# Altium schematic sheet Isolated Supply.SchDoc
size A4; DocumentNumber: 2; SheetNumber: 2; SheetTotal: 3
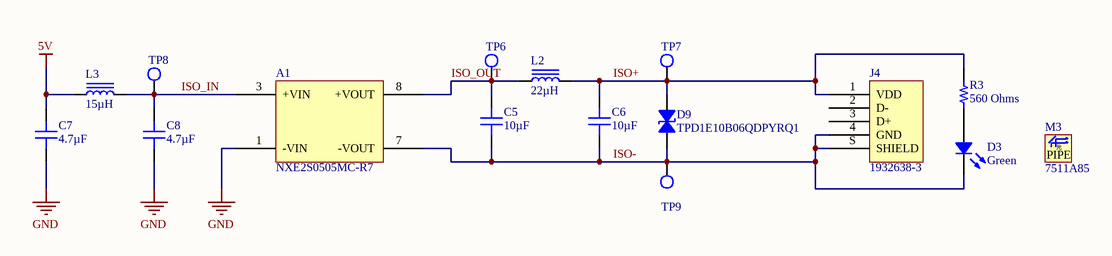
[diagram p0: Isolated Supply.SchDoc]

## Parts
A1  NXE2S0505MC-R7  [MURATA NXE]
C5  10µF  [CAP 1206_3216 - 1.8MM]
C6  10µF  [CAP 1206_3216 - 1.8MM]
C7  4.7µF  [CAP 1206_3216 - 1.8MM]
C8  4.7µF  [CAP 1206_3216 - 1.8MM]
D3  Green  [LED 0805_2012 GREEN]
D9  TPD1E10B06QDPYRQ1  [0402]
J4  1932638-3  [TE 1932638-3 USB2.0A]
L2  22µH  [TDK VLCF4024-2]
L3  15µH  [TDK VLCF4028-2]
M3  7511A85  [VCC 7511A85]
R3  560 Ohms  [RES 0603_1608]
TP6  Test Point  [TestPoint-1.5mm]  (value not drawn)  (no BOM)
TP7  Test Point  [TestPoint-1.5mm]  (value not drawn)  (no BOM)
TP8  Test Point  [TestPoint-1.5mm]  (value not drawn)  (no BOM)
TP9  Test Point  [TestPoint-1.5mm]  (value not drawn)  (no BOM)

## Nets
5V: C7.1 L3.1
GND: A1.1(-VIN) C7.2 C8.2
ISO+: C6.1 D9.2 J4.1(VDD) L2.2 R3.1 TP7.1(TP)
ISO-: A1.7(-VOUT) C5.2 C6.2 D3.2 D9.1 J4.4(GND) J4.S(SHIELD) TP9.1(TP)
ISO_IN: A1.3(+VIN) C8.1 L3.2 TP8.1(TP)
ISO_OUT: A1.8(+VOUT) C5.1 L2.1 TP6.1(TP)
NetD3_1: D3.1 R3.2

Not connected (* = marked no-connect by the designer): J4 2(D-) 3(D+)

## Notes on the sheet
- Title
- Size:
- Date:
- A4
- Number:
- Time:
- Revision:
- Sheet
- of
- File:
- (in symbol 7511A85) 光; PIPE

## Library data of the parts
A1 = NXE2S0505MC-R7: DC DC CONVERTER 5V 2W; Manufacturer: Murata Power Solutions Inc.; Current - Output (Max): 400mA; Efficiency: 72%; Number of Outputs: 1; Voltage - Input (Max): 5.5V; Voltage - Input (Min): 4.5V; Voltage - Isolation: 3kV; Part Number: NXE2S0505MC-R7; Applications: ITE (Commercial); ComponentLink1Description: Datasheet; ComponentLink1URL: https://power.murata.com/data/power/ncl/kdc_nxe2.pdf; ComponentLink2Description: DigiKey Link; ComponentLink2URL: //digikey.com/product-detail/en/murata-power-solutions-inc/NXE2S0505MC-R7/811-3182-2-ND/6009739; Device Package: 14-SMD Module, 5 Leads; Features: SCP; LastUpdated: 04/12/2019 23:42:39; Lifecycle Status: 0; Minimum Order: 1; Mounting Type: Surface Mount; Operating Temperature: -40°C ~ 85°C; Package / Case: 14-SMD Module, 5 Leads; Packaging: TapeAndReel; PartId: 2; Part Status: Active; Power (Watts): 2W; Price: 3.83; Series: NXE2 (2W); Size / Dimension: 0.50" L x 0.40" W x 0.17" H (12.7mm x 10.4mm x 4.4mm); Supplier 1: DigiKey; Supplier Part Number 1: 811-3182-2-ND; Type: Isolated Module; Voltage - Output 1: 5V
C5 C6 = CL31B106MOHNNNE: CAP CER 10UF 16V X7R 1206; Manufacturer: Samsung Electro-Mechanics; Tolerance: ±20%; Part Number: CL31B106MOHNNNE; Applications: General Purpose; Capacitance: 10µF; ComponentLink1Description: Datasheet; ComponentLink1URL: http://www.samsungsem.com/kr/support/product-search/mlcc/CL31B106MOHNNNE.jsp; ComponentLink2Description: DigiKey Link; ComponentLink2URL: //digikey.com/product-detail/en/samsung-electro-mechanics/CL31B106MOHNNNE/1276-6641-2-ND/5961125; Device Package: 1206 (3216 Metric); LastUpdated: 29/11/2019 21:36:18; Lifecycle Status: 0; Minimum Order: 1; Mounting Type: Surface Mount, MLCC; Operating Temperature: -55°C ~ 125°C; Package / Case: 1206 (3216 Metric); Packaging: TapeAndReel; PartId: 21983; Part Status: Active; Price: 0.04; Series: CL; Size / Dimension: 0.126" L x 0.063" W (3.20mm x 1.60mm); Supplier 1: DigiKey; Supplier Part Number 1: 1276-6641-2-ND; Temperature Coefficient: X7R; Thickness (Max): 0.071" (1.80mm); Value: 10µF; Voltage - Rated: 16V
C7 C8 = CL31B475KOHNNNE: CAP CER 4.7UF 16V X7R 1206; Manufacturer: Samsung Electro-Mechanics; Tolerance: ±10%; Part Number: CL31B475KOHNNNE; Applications: General Purpose; Capacitance: 4.7µF; ComponentLink1Description: Datasheet; ComponentLink1URL: http://www.samsungsem.com/kr/support/product-search/mlcc/CL31B475KOHNNNE.jsp; ComponentLink2Description: DigiKey Link; ComponentLink2URL: //digikey.com/product-detail/en/samsung-electro-mechanics/CL31B475KOHNNNE/1276-3182-2-ND/3888840; Device Package: 1206 (3216 Metric); LastUpdated: 29/11/2019 21:36:24; Lifecycle Status: 0; Minimum Order: 1; Mounting Type: Surface Mount, MLCC; Operating Temperature: -55°C ~ 125°C; Package / Case: 1206 (3216 Metric); Packaging: TapeAndReel; PartId: 22712; Part Status: Active; Price: 0.05; Series: CL; Size / Dimension: 0.126" L x 0.063" W (3.20mm x 1.60mm); Supplier 1: DigiKey; Supplier Part Number 1: 1276-3182-2-ND; Temperature Coefficient: X7R; Thickness (Max): 0.071" (1.80mm); Value: 4.7µF; Voltage - Rated: 16V
D3 = LTST-C170GKT: LED GREEN CLEAR SMD; Manufacturer: Lite-On Inc.; Configuration: Standard; Current - Test: 10mA; Lens Color: Colorless; Lens Size: 1.40mm x 1.25mm; Lens Style: Rectangle with Flat Top; Millicandela Rating: 6mcd; Viewing Angle: 130°; Voltage - Forward (Vf) (Typ): 2.1V; Wavelength - Dominant: 569nm; Wavelength - Peak: 565nm; Part Number: LTST-C170GKT; Color: Green; ComponentLink1Description: Datasheet; ComponentLink1URL: //media.digikey.com/pdf/Data%20Sheets/Lite-On%20PDFs/LTST-C170GKT.pdf; ComponentLink2Description: DigiKey Link; ComponentLink2URL: http://digikey.com/product-detail/en/lite-on-inc/LTST-C170GKT/160-1179-1-ND/269251; Device Package: 0805 (2012 Metric); Height (Max): 1.10mm; LastUpdated: 21/01/2020 03:14:10; Lens Transparency: Clear; Lifecycle Status: Active; Minimum Order: 1; Mounting Type: Surface Mount; Package / Case: 0805 (2012 Metric); Packaging: TapeAndReel; PartId: 282; Part Status: Active; Price: 0.05; Series: -; Size / Dimension: 2.00mm L x 1.25mm W; Supplier 1: DigiKey; Supplier Part Number 1: 160-1179-1-ND; Value: Green
D9 = TPD1E10B06QDPYRQ1: TVS DIODE 5.5V 14V 2X1SON; Manufacturer: Texas Instruments; Bidirectional Channels: 1; Capacitance @ Frequency: 12pF @ 1MHz; Current - Peak Pulse (10/1000µs): 6A (8/20µs); Power Line Protection: No; Power - Peak Pulse: 90W; Type: Zener; Voltage - Breakdown (Min): 6V; Voltage - Clamping (Max) @ Ipp: 14V (Typ); Voltage - Reverse Standoff (Typ): 5.5V (Max); Part Number: TPD1E10B06QDPYRQ1; Applications: Automotive; ComponentLink1Description: Datasheet; ComponentLink1URL: http://www.ti.com/general/docs/suppproductinfo.tsp?distId=10&gotoUrl=http%3A%2F%2Fwww.ti.com%2Flit%2Fgpn%2Ftpd1e10b06-q1; ComponentLink2Description: DigiKey Link; ComponentLink2URL: http://digikey.com/product-detail/en/texas-instruments/TPD1E10B06QDPYRQ1/296-TPD1E10B06QDPYRQ1CT-ND/6609868; Device Package: 0402 (1006 Metric); LastUpdated: 21/03/2020 02:05:15; Lifecycle Status: Active; Minimum Order: 1; Mounting Type: Surface Mount; Operating Temperature: -40°C ~ 125°C (TA); Package / Case: 0402 (1006 Metric); Packaging: TapeAndReel; PartId: 10475; Part Status: Active; Price: 0.08; Series: Automotive, AEC-Q101; Supplier 1: DigiKey; Supplier Part Number 1: 296-TPD1E10B06QDPYRQ1CT-ND; Supplier Device Package: 2-X1SON (1x.60)
J4 = 1932638-3: CONN RCPT USB2.0 TYPEA 4P SMD RA; Manufacturer: TE Connectivity AMP Connectors; Connector Type: USB - A; Current Rating (Amps): 1A per Contact; Gender: Receptacle; Mating Cycles: 1500; Number of Contacts: 4; Number of Ports: 1; Shielding: Shielded; Voltage - Rated: 30VAC; Part Number: 1932638-3; ComponentLink1Description: Datasheet; ComponentLink1URL: https://www.te.com/commerce/DocumentDelivery/DDEController?Action=srchrtrv&DocNm=501-60007-1&DocType=SS&DocLang=EN; ComponentLink2Description: DigiKey Link; ComponentLink2URL: //digikey.com/product-detail/en/te-connectivity-amp-connectors/1932638-3/A117902TR-ND/4731612; Features: Solder Retention; LastUpdated: 09/12/2019 20:47:08; Lifecycle Status: 0; Minimum Order: 1; Mounting Feature: Horizontal; Mounting Type: Surface Mount, Right Angle; Operating Temperature: -55°C ~ 85°C; Packaging: TapeAndReel; Part Status: Active; Price: 0.97; Series: -; Specifications: USB 2.0; Supplier 1: DigiKey; Supplier Part Number 1: A117902TR-ND; Termination: Solder
L2 = VLCF4024T-220MR65-2: FIXED IND 22UH 650MA 332 MOHM; Manufacturer: TDK Corporation; DC Resistance (DCR): 332mOhm Max; Inductance Frequency - Test: 100kHz; Material - Core: Ferrite; Shielding: Shielded; Tolerance: ±20%; Type: Wirewound; Part Number: VLCF4024T-220MR65-2; ComponentLink1Description: Datasheet; ComponentLink1URL: https://product.tdk.com/info/en/catalog/datasheets/inductor_commercial_power_vlcf4024-2_en.pdf?ref_disty=digikey; ComponentLink2Description: DigiKey Link; ComponentLink2URL: //digikey.com/product-detail/en/tdk-corporation/VLCF4024T-220MR65-2/445-8732-2-ND/3083283; Current Rating (Amps): 650mA; Current - Saturation: 650mA; Device Package: Nonstandard; Height - Seated (Max): 0.094" (2.40mm); Inductance: 22µH; LastUpdated: 02/12/2019 13:29:53; Lifecycle Status: 0; Minimum Order: 1; Mounting Type: Surface Mount; Operating Temperature: -40°C ~ 105°C; Package / Case: Nonstandard; Packaging: TapeAndReel; PartId: 165; Part Status: Active; Price: 0.44; Series: VLCF; Size / Dimension: 0.157" L x 0.157" W (4.00mm x 4.00mm); Supplier 1: DigiKey; Supplier Part Number 1: 445-8732-2-ND; Value: 22µH
L3 = VLCF4028T-150MR88-2: FIXED IND 15UH 880MA 170 MOHM; Manufacturer: TDK Corporation; DC Resistance (DCR): 170mOhm Max; Inductance Frequency - Test: 100kHz; Material - Core: Ferrite; Shielding: Shielded; Tolerance: ±20%; Type: Wirewound; Part Number: VLCF4028T-150MR88-2; ComponentLink1Description: Datasheet; ComponentLink1URL: https://product.tdk.com/info/en/catalog/datasheets/inductor_commercial_power_vlcf4028-2_en.pdf?ref_disty=digikey; ComponentLink2Description: DigiKey Link; ComponentLink2URL: //digikey.com/product-detail/en/tdk-corporation/VLCF4028T-150MR88-2/445-6543-2-ND/2465300; Current Rating (Amps): 880mA; Current - Saturation: 880mA; Device Package: Nonstandard; Height - Seated (Max): 0.110" (2.80mm); Inductance: 15µH; LastUpdated: 02/12/2019 13:32:15; Lifecycle Status: 0; Minimum Order: 1; Mounting Type: Surface Mount; Operating Temperature: -40°C ~ 105°C; Package / Case: Nonstandard; Packaging: TapeAndReel; PartId: 183; Part Status: Active; Price: 0.44; Series: VLCF; Size / Dimension: 0.157" L x 0.157" W (4.00mm x 4.00mm); Supplier 1: DigiKey; Supplier Part Number 1: 445-6543-2-ND; Value: 15µH
M3 = 7511A85: LIGHT PIPE RIGHT ANG SINGLE POS; Manufacturer: Visual Communications Company - VCC; Lens Size: 3mm; Lens Style: Round with Flat Top; Color: Clear; ComponentLink1Description: Datasheet; ComponentLink1URL: https://vcclite.com/wp-content/uploads/wpallimport/files/files/7511A85%207511A62%207511B11%20Series%20BrightPipes%20Optical%20Lightpipes.pdf; ComponentLink2Description: DigiKey Link; ComponentLink2URL: http://digikey.com/product-detail/en/visual-communications-company-vcc/7511A85/L70510-ND/397876; Configuration: Single; LastUpdated: 20/03/2020 05:35:42; Lifecycle Status: Active; Part Number: 7511A85; Minimum Order: 1; Mounting Type: Board Mount, Press Fit, Right Angle; Packaging: Unknown; Part Status: Active; Price: 0.93; Series: Bright Pipes™, 7511; Supplier 1: DigiKey; Supplier Part Number 1: L70510-ND; Type: Rigid
R3 = ERJ-PA3J561V: RES SMD 560 OHM 5% 1/4W 0603; Manufacturer: Panasonic Electronic Components; Power (Watts): 0.25W, 1/4W; Temperature Coefficient: ±200ppm/°C; Part Number: ERJ-PA3J561V; Value: 560 Ohms; ComponentLink1Description: Datasheet; ComponentLink1URL: https://industrial.panasonic.com/cdbs/www-data/pdf/RDO0000/AOA0000C331.pdf; ComponentLink2Description: DigiKey Link; ComponentLink2URL: http://digikey.com/product-detail/en/panasonic-electronic-components/ERJ-PA3J561V/P560BZCT-ND/5036343; Composition: Thick Film; Device Package: 0603 (1608 Metric); Features: Automotive AEC-Q200, Pulse Withstanding; Height - Seated (Max): 0.022" (0.55mm); LastUpdated: 21/01/2020 00:18:33; Lifecycle Status: Active; Minimum Order: 1; Number of Terminations: 2; Operating Temperature: -55°C ~ 155°C; Package / Case: 0603 (1608 Metric); Packaging: TapeAndReel; PartId: 20561; Part Status: Active; Price: 0.01; Ratings: AEC-Q200; Resistance: 560 Ohms; Series: ERJ; Size / Dimension: 0.063" L x 0.031" W (1.60mm x 0.80mm); Supplier 1: DigiKey; Supplier Part Number 1: P560BZCT-ND; Supplier Device Package: 0603; Tolerance: ±5%